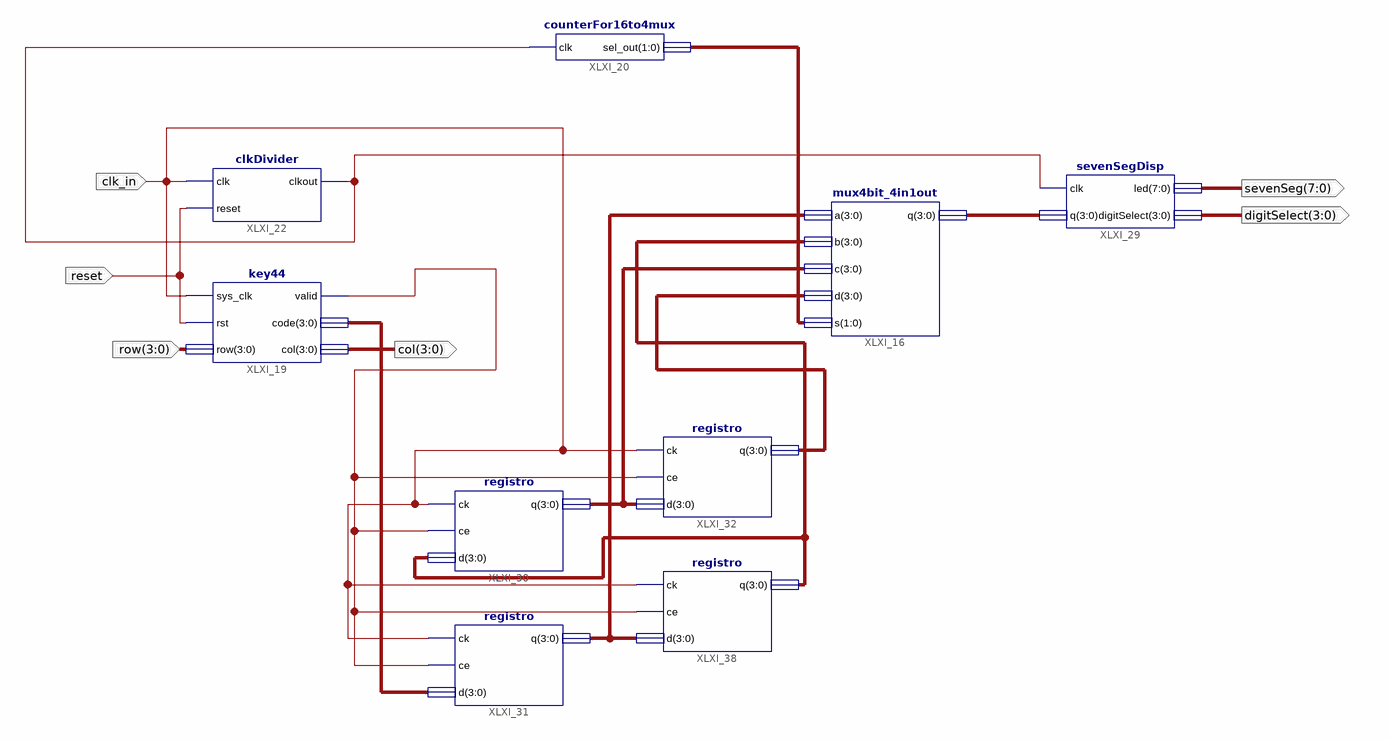
[diagram p0: schematic sheet 1]
// Xilinx ISE schematic top.sch (spartan3e) as structural Verilog: 9 symbols, 6 ports
module top (
  input  [3:0] row,
  input  clk_in,
  input  reset,
  output [3:0] col,
  output [7:0] sevenSeg,
  output [3:0] digitSelect
);

  wire XLXN_133, XLXN_138;
  wire [1:0] XLXN_92;
  wire [3:0] XLXN_82, XLXN_115, XLXN_116, XLXN_124, XLXN_125, XLXN_127;

  mux4bit_4in1out XLXI_16 (.a(XLXN_124), .b(XLXN_125), .c(XLXN_127), .d(XLXN_115), .s(XLXN_92), .q(XLXN_116));
  counterFor16to4mux XLXI_20 (.clk(XLXN_133), .sel_out(XLXN_92));
  key44 XLXI_19 (.sys_clk(clk_in), .rst(reset), .row(row), .valid(XLXN_138), .code(XLXN_82), .col(col));
  clkDivider XLXI_22 (.clk(clk_in), .reset(reset), .clkout(XLXN_133));
  sevenSegDisp XLXI_29 (.clk(XLXN_133), .q(XLXN_116), .led(sevenSeg), .digitSelect(digitSelect));
  registro XLXI_30 (.ck(clk_in), .ce(XLXN_138), .d(XLXN_125), .q(XLXN_127));
  registro XLXI_31 (.ck(clk_in), .ce(XLXN_138), .d(XLXN_82), .q(XLXN_124));
  registro XLXI_32 (.ck(clk_in), .ce(XLXN_138), .d(XLXN_127), .q(XLXN_115));
  registro XLXI_38 (.ck(clk_in), .ce(XLXN_138), .d(XLXN_124), .q(XLXN_125));
endmodule
